# Altium schematic sheet 数控936 控制核心.SchDoc
size A4
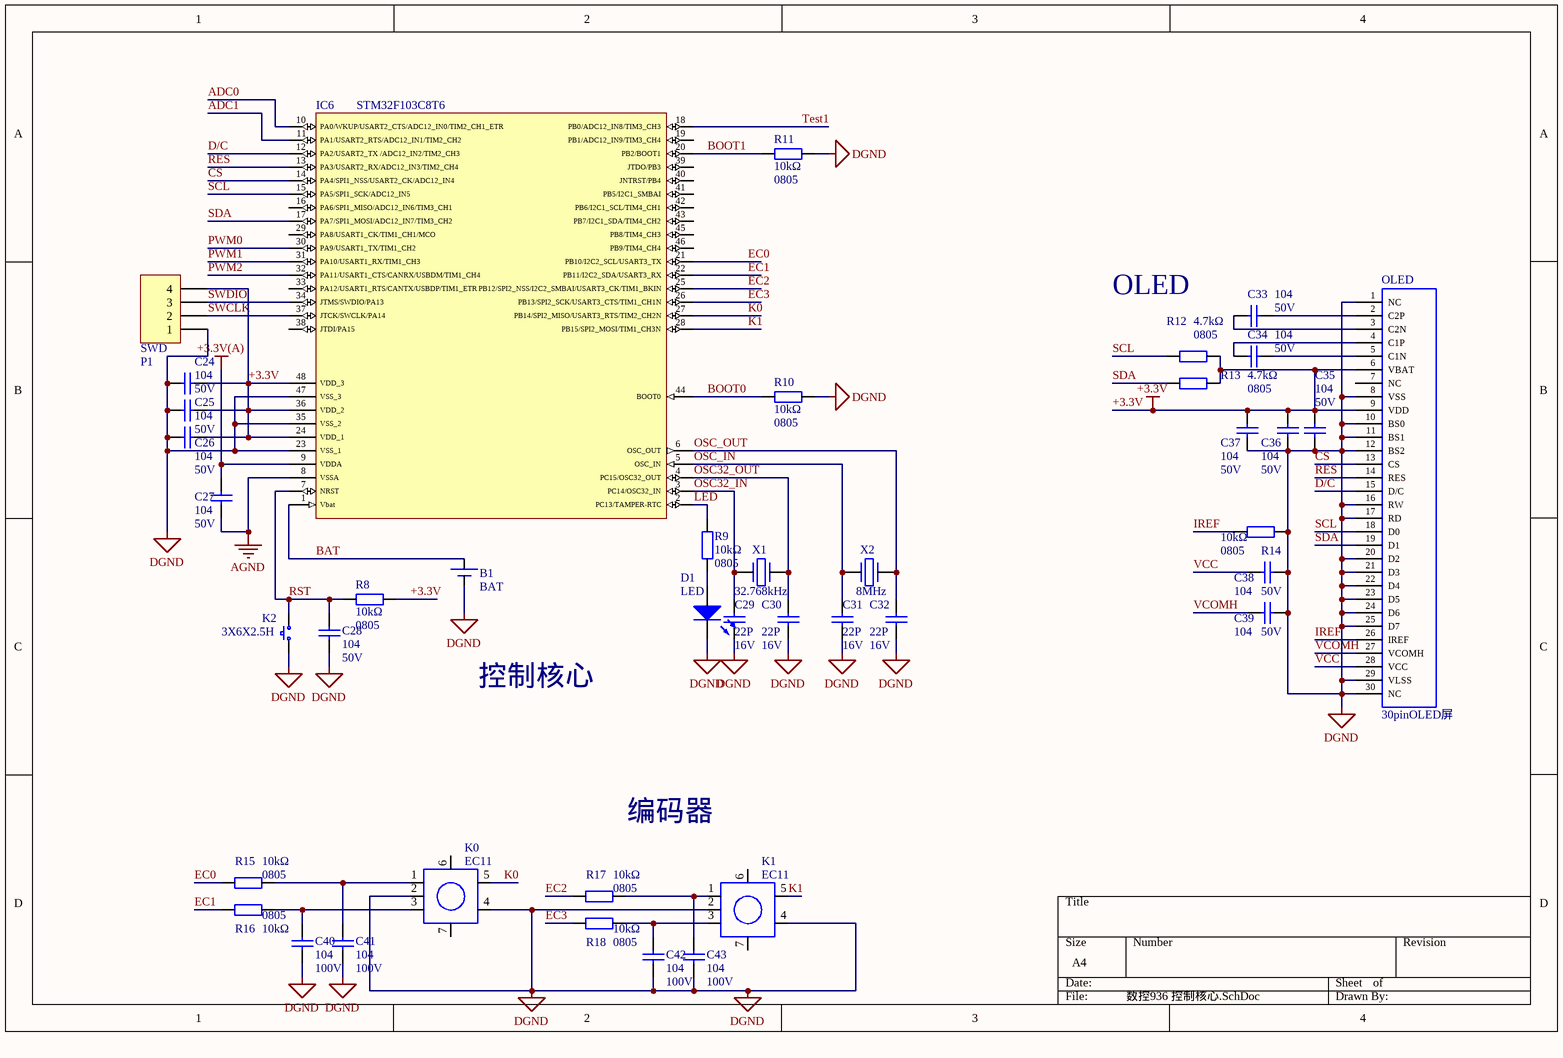
[diagram p0: 数控936 控制核心.SchDoc]

## Parts
B1  BAT  [CR1220]
C24  104  value 50V  [C0805]
C25  104  value 50V  [C0805]
C26  104  value 50V  [C0805]
C27  104  value 50V  [C0805]
C28  104  value 50V  [C0805]
C29  22P  value 16V  [C0805]
C30  22P  value 16V  [C0805]
C31  22P  value 16V  [C0805]
C32  22P  value 16V  [C0805]
C33  104  value 50V  [C0805]
C34  104  value 50V  [C0805]
C35  104  value 50V  [C0805]
C36  104  value 50V  [C0805]
C37  104  value 50V  [C0805]
C38  104  value 50V  [C0805]
C39  104  value 50V  [C0805]
C40  104  value 100V  [C0805]
C41  104  value 100V  [C0805]
C42  104  value 100V  [C0805]
C43  104  value 100V  [C0805]
D1  LED  [LED0805(蓝色)]
IC6  STM32F103C8T6  [LQFP-48(0.5MM) - duplicate]
K0  EC11  [EC11]
K1  EC11  [EC11]
K2  3X6X2.5H  [3X6X2.5H]
OLED  30pinOLED屏  [OLED-0.96(穿透)]
P1  SWD  [HDR2.54-LI-4P]
R8  10kΩ  value 0805  [R0805]
R9  10kΩ  value 0805  [R0805]
R10  10kΩ  value 0805  [R0805]
R11  10kΩ  value 0805  [R0805]
R12  4.7kΩ  value 0805  [R0805]
R13  4.7kΩ  value 0805  [R0805]
R14  10kΩ  value 0805  [R0805]
R15  10kΩ  value 0805  [R0805]
R16  10kΩ  value 0805  [R0805]
R17  10kΩ  value 0805  [R0805]
R18  10kΩ  value 0805  [R0805]
X1  32.768kHz  [OSC-2x6-WS]
X2  8MHz  [OSC HC-49SMD]

## Nets
+3.3V: C24.2 C25.2 C26.2 C35.2 C36.2 C37.2 IC6.24(VDD_1) IC6.36(VDD_2) IC6.48(VDD_3) OLED.6(VBAT) OLED.9(VDD) P1.4 R8.2 R12.2 R13.2
+3.3V(A): C27.2 IC6.9(VDDA)
AGND: C27.1 IC6.8(VSSA)
DGND: B1.2(-) C24.1 C25.1 C26.1 C28.1 C29.1 C30.1 C31.1 C32.1 C35.1 C36.1 C37.1 C38.2 C39.2 C40.1 C41.1 C42.1 C43.1 D1.2(K) IC6.23(VSS_1) IC6.35(VSS_2) IC6.47(VSS_3) K0.2(C) K0.4(K1) K1.2(C) K1.4(K1) K2.1 OLED.1(NC) OLED.8(VSS) OLED.10(BS0) OLED.11(BS1) OLED.12(BS2) OLED.16(RW) OLED.17(RD) OLED.20(D2) OLED.21(D3) OLED.22(D4) OLED.23(D5) OLED.24(D6) OLED.25(D7) OLED.29(VLSS) OLED.30(NC) P1.1 R10.1 R11.2 R14.2
ADC0: IC6.10(PA0/WKUP/USART2_CTS/ADC12_IN0/TIM2_CH1_ETR)
ADC1: IC6.11(PA1/USART2_RTS/ADC12_IN1/TIM2_CH2)
BAT: B1.1(+) IC6.1(Vbat)
BOOT0: IC6.44(BOOT0) R10.2
BOOT1: IC6.20(PB2/BOOT1) R11.1
CS: IC6.14(PA4/SPI1_NSS/USART2_CK/ADC12_IN4) OLED.13(CS)
D/C: IC6.12(PA2/USART2_TX_/ADC12_IN2/TIM2_CH3) OLED.15(D/C)
EC0: IC6.21(PB10/I2C2_SCL/USART3_TX) R15.1
EC1: IC6.22(PB11/I2C2_SDA/USART3_RX) R16.1
EC2: IC6.25(PB12/SPI2_NSS/I2C2_SMBAI/USART3_CK/TIM1_BKIN) R17.1
EC3: IC6.26(PB13/SPI2_SCK/USART3_CTS/TIM1_CH1N) R18.1
IREF: OLED.26(IREF) R14.1
K0: IC6.27(PB14/SPI2_MISO/USART3_RTS/TIM2_CH2N) K0.5(K2)
K1: IC6.28(PB15/SPI2_MOSI/TIM1_CH3N) K1.5(K2)
LED: IC6.2(PC13/TAMPER-RTC) R9.2
OSC32_IN: C29.2 IC6.3(PC14/OSC32_IN) X1.1
OSC32_OUT: C30.2 IC6.4(PC15/OSC32_OUT) X1.2
OSC_IN: C31.2 IC6.5(OSC_IN) X2.2
OSC_OUT: C32.2 IC6.6(OSC_OUT) X2.1
PWM0: IC6.30(PA9/USART1_TX/TIM1_CH2)
PWM1: IC6.31(PA10/USART1_RX/TIM1_CH3)
PWM2: IC6.32(PA11/USART1_CTS/CANRX/USBDM/TIM1_CH4)
RES: IC6.13(PA3/USART2_RX/ADC12_IN3/TIM2_CH4) OLED.14(RES)
RST: C28.2 IC6.7(NRST) K2.2 R8.1
SCL: IC6.15(PA5/SPI1_SCK/ADC12_IN5) OLED.18(D0) R12.1
SDA: IC6.17(PA7/SPI1_MOSI/ADC12_IN7/TIM3_CH2) OLED.19(D1) R13.1
SWCLK: IC6.37(JTCK/SWCLK/PA14) P1.2
SWDIO: IC6.34(JTMS/SWDIO/PA13) P1.3
Test1: IC6.18(PB0/ADC12_IN8/TIM3_CH3)
VCC: C38.1 OLED.28(VCC)
VCOMH: C39.1 OLED.27(VCOMH)
NetC33_1: C33.1 OLED.2(C2P)
NetC33_2: C33.2 OLED.3(C2N)
NetC34_1: C34.1 OLED.5(C1N)
NetC34_2: C34.2 OLED.4(C1P)
NetC40_2: C40.2 K0.3(B) R16.2
NetC41_2: C41.2 K0.1(A) R15.2
NetC42_2: C42.2 K1.3(B) R18.2
NetC43_2: C43.2 K1.1(A) R17.2
NetD1_1: D1.1(A) R9.1

Not connected (* = marked no-connect by the designer): IC6 16(PA6/SPI1_MISO/ADC12_IN6/TIM3_CH1) 19(PB1/ADC12_IN9/TIM3_CH4) 29(PA8/USART1_CK/TIM1_CH1/MCO) 33(PA12/USART1_RTS/CANTX/USBDP/TIM1_ETR) 38(JTDI/PA15) 39(JTDO/PB3) 40(JNTRST/PB4) 41(PB5/I2C1_SMBAI) 42(PB6/I2C1_SCL/TIM4_CH1) 43(PB7/I2C1_SDA/TIM4_CH2) 45(PB8/TIM4_CH3) 46(PB9/TIM4_CH4); K0 6 7; K1 6 7; OLED 7(NC)

## Notes on the sheet
- OLED
- 控制核心
- 编码器

## Library data of the parts
B1 = BAT: 电池
C24-C43 = 104: 无极性电容
IC6 = STM32F103C8T6: STM32单片机
K0 K1 = EC11: 旋转编码器
K2 = 3X6X2.5H: 贴片按键
OLED = 30pinOLED屏: 0.96寸
P1 = Header 4: Header, 4-Pin; LatestRevisionDate: 17-Jul-2002; LatestRevisionNote: Re-released for DXP Platform.; Publisher: Altium Limited
R8-R18 = 10kΩ: 贴片/直插电阻
X1 X2 = 8MHz: 无源晶振